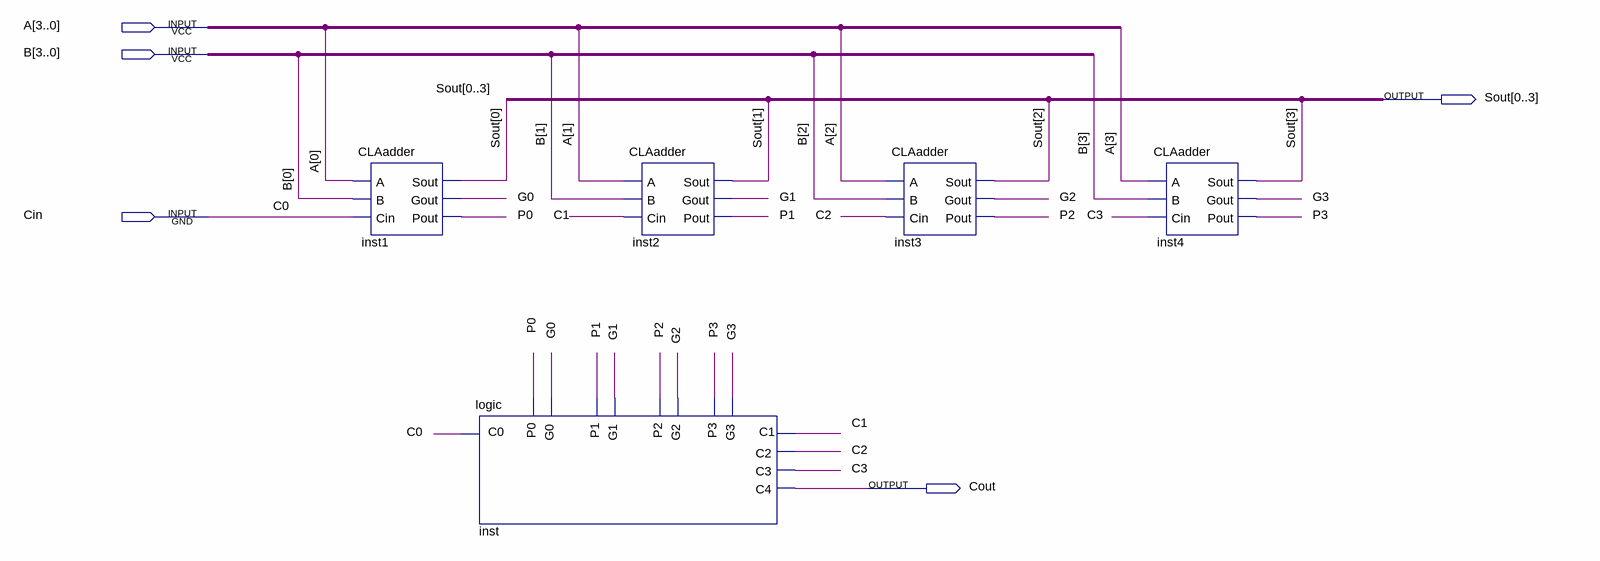
[diagram p0: schematic sheet]
// Quartus schematic CLA_adder.bdf as structural Verilog: 5 symbols, 5 pins
module CLA_adder (
  input  [3:0] A,
  input  [3:0] B,
  input  Cin,
  output [0:3] Sout,
  output Cout
);

  wire C1, C2, C3, G0, G1, G2, G3, P0, P1, P2, P3;

  CLAadder inst1 (.A(A[0]), .B(B[0]), .Cin(Cin), .Sout(Sout[0]), .Gout(G0), .Pout(P0));
  \logic  inst (
    .C0(Cin), .P0(P0), .P1(P1), .P2(P2), .P3(P3), .G0(G0), .G1(G1), .G2(G2), .G3(G3), .C1(C1), .C2(C2),
    .C3(C3), .C4(Cout));
  CLAadder inst2 (.A(A[1]), .B(B[1]), .Cin(C1), .Sout(Sout[1]), .Gout(G1), .Pout(P1));
  CLAadder inst3 (.A(A[2]), .B(B[2]), .Cin(C2), .Sout(Sout[2]), .Gout(G2), .Pout(P2));
  CLAadder inst4 (.A(A[3]), .B(B[3]), .Cin(C3), .Sout(Sout[3]), .Gout(G3), .Pout(P3));

  // Other names for the same wires on the sheet: C0 = Cin
endmodule
